# EAGLE schematic Schematic v42 (EAGLE 9.7.0)
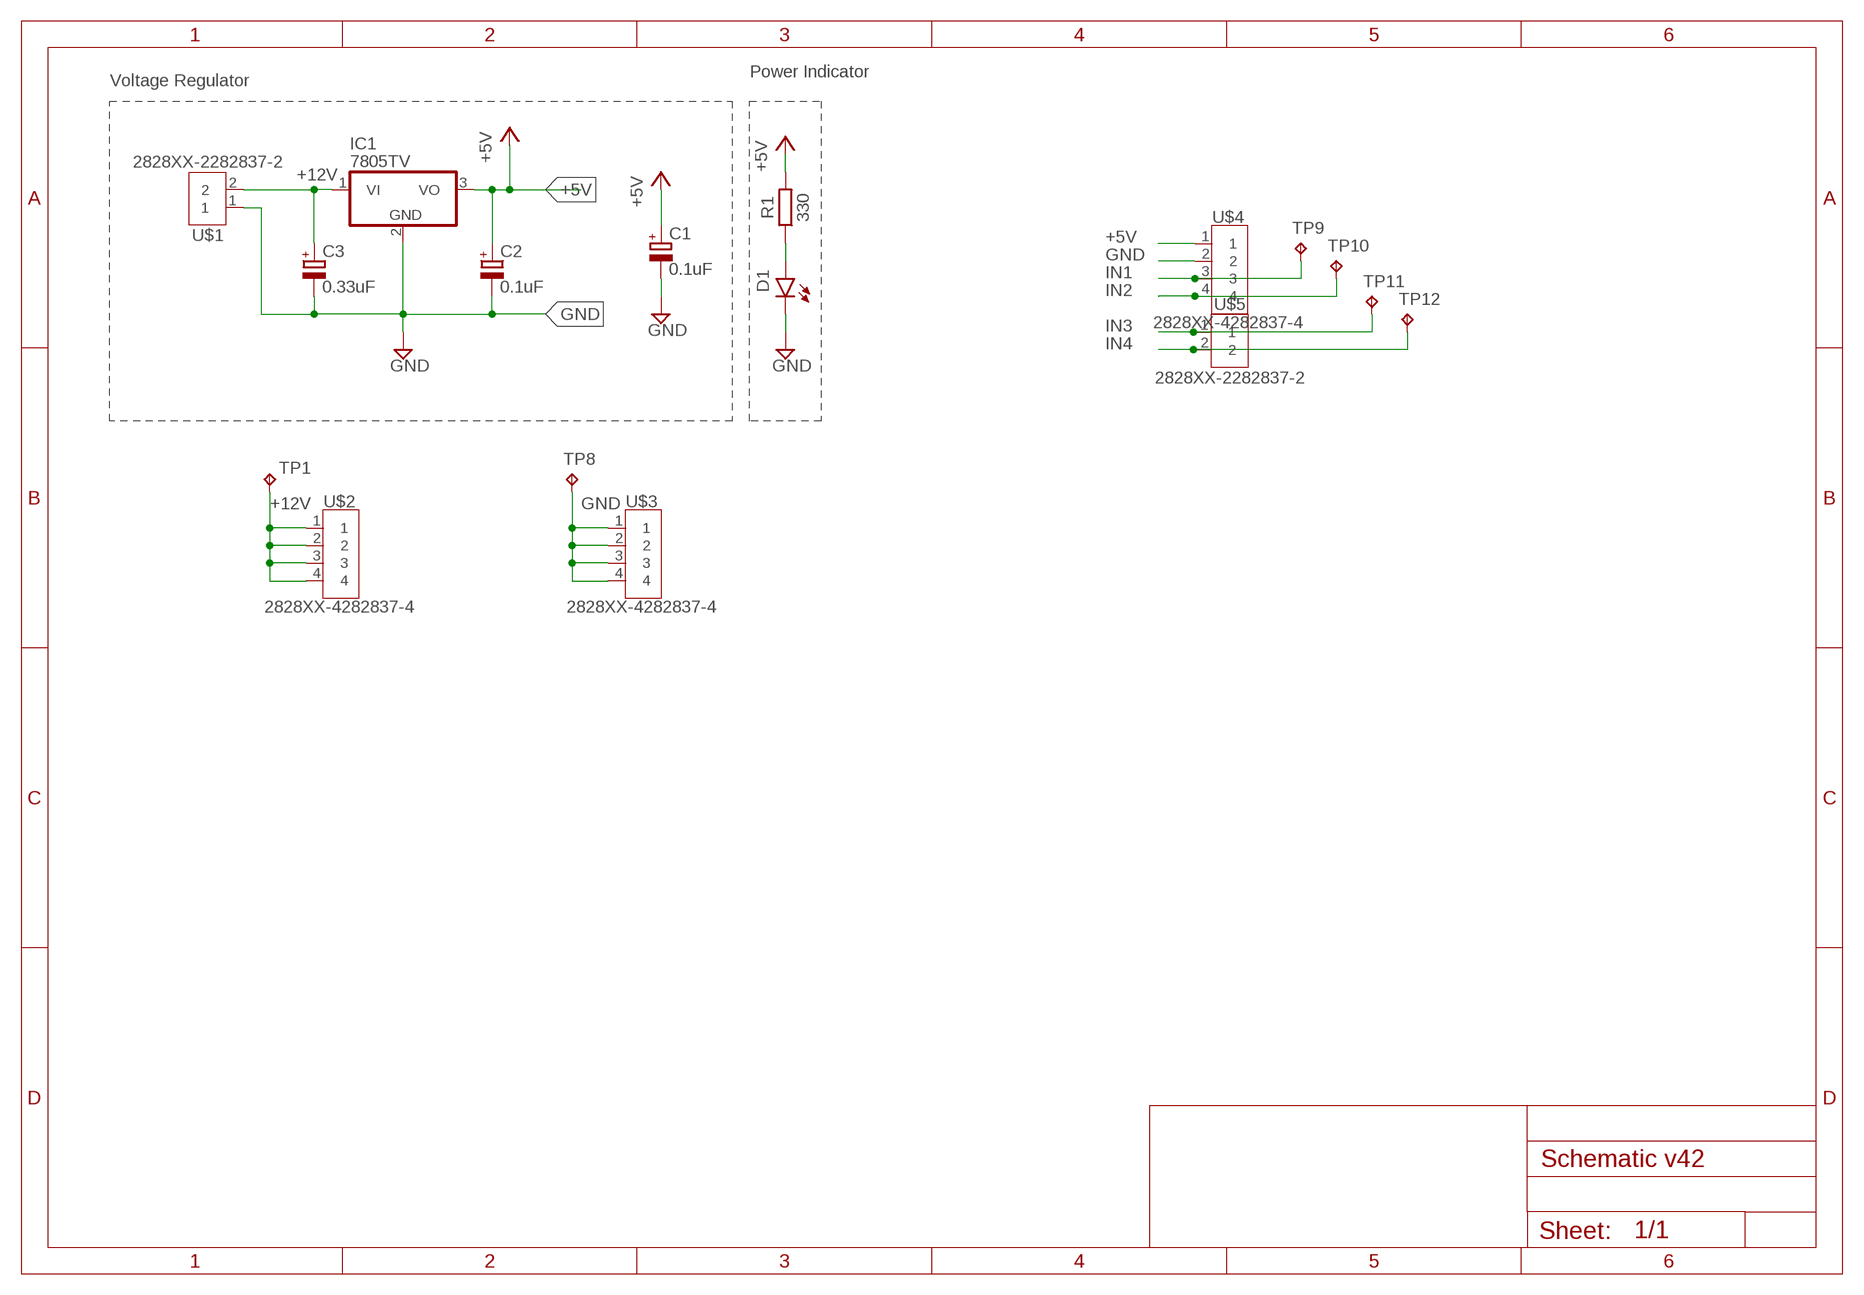
[diagram p0: schematic, sheet 1]

## Parts
C1  0.1uF  C-POL_RADIAL-11MM-DIA  [CAPPRD508W65D1000H1100B]
C2  0.1uF  C-POL_RADIAL-11MM-DIA  [CAPPRD508W65D1000H1100B]
C3  0.33uF  C-POL_RADIAL-25MM-DIA  [CAPPRD550W110D1250H2500B]
D1  LED_ORANGE  LED_RADIAL_ORANGE  [LEDRD254W60D565H860B_O]
IC1  7805TV  [TO220V]
R1  330  R_AXIAL-7.2MM-PITCH  [RESAD724W46L381D178B]
TP1  TPPAD1-20  [P1-20]
TP8  TPPAD1-20  [P1-20]
TP9  TPPAD1-20  [P1-20]
TP10  TPPAD1-20  [P1-20]
TP11  TPPAD1-20  [P1-20]
TP12  TPPAD1-20  [P1-20]
U$1  2828XX-2282837-2  [TERMBLK_508-2N]
U$2  2828XX-4282837-4  [TERMBLK_508-4N]
U$3  2828XX-4282837-4  [TERMBLK_508-4N]
U$4  2828XX-4282837-4  [TERMBLK_508-4N]
U$5  2828XX-2282837-2  [TERMBLK_508-2N]

## Nets
+5V: C1.1(+) C2.1(+) IC1.3(VO) R1.2 U$4.1
+12V: C3.1(+) IC1.1(VI) TP1.TP U$1.2 U$2.1 U$2.2 U$2.3 U$2.4
GND: C1.2(-) C2.2(-) C3.2(-) D1.2(C) IC1.2(GND) TP8.TP U$1.1 U$3.1 U$3.2 U$3.3 U$3.4 U$4.2
IN1: TP9.TP U$4.3
IN2: TP10.TP U$4.4
IN3: TP11.TP U$5.1
IN4: TP12.TP U$5.2
N$2: D1.1(A) R1.1

## Notes on the sheet
- Power Indicator
- Voltage Regulator

## Library data of the parts
C1-C3 = Capacitor:C-POL: Capacitor Polarised - Generic; CATEGORY: Capacitor
D1 = Tinkercad:LED_RADIAL: LED - Generic; CATEGORY: Opto-Electronic; SUB-CATEGORY: LED
IC1 = linear:78*: Positive VOLTAGE REGULATOR Source: http://cache.national.com/ds/LM/LM78L05.pdf http://www.fairchildsemi.com/ds/LM/LM7805.pdf
R1 = Resistor:R: Resistor Fixed - Generic; CATEGORY: Resistor; SUB-CATEGORY: Fixed
TP1 TP8-TP12 = testpad:TP: Test pad
U$1 = Connector:2828XX-2: 2 Position Wire to Board Terminal Block Horizontal with Board Datasheet <https://www.te.com.cn/commerce/DocumentDelivery/DDEController?Action=showdoc&DocId=Catalog+Section%7F1308389_EUROSTYLE_TERMINAL_BLOCKS%7F0607%7Fpdf%7FEnglish%7FENG_CS_1308389_EUROSTYLE_TERMINAL_BLOCKS_0607.pdf%7F2-282837-5>; CATEGORY: Connector; DESCRIPTION: 2 Position Wire to Board Terminal Block Horizontal with Board 5.08 mm Through Hole; MANUFACTURER: TE Connectivity; MPN: 282837-2; OPERATING_TEMPERATURE: -40°C to +105°C; PART_STATUS: ACTIVE; ROHS_COMPLIANCE: RoHS Compliant; SERIES: 282837; SPICEPREFIX: B; SUBCATEGORY: Terminal Block; TYPE: Side Wire Entry
U$2-U$4 = Connector:2828XX-4: 4 Position Wire to Board Terminal Block Horizontal with Board Datasheet <https://www.te.com.cn/commerce/DocumentDelivery/DDEController?Action=showdoc&DocId=Catalog+Section%7F1308389_EUROSTYLE_TERMINAL_BLOCKS%7F0607%7Fpdf%7FEnglish%7FENG_CS_1308389_EUROSTYLE_TERMINAL_BLOCKS_0607.pdf%7F2-282837-5>; CATEGORY: Connector; DESCRIPTION: TERM BLK 4P SIDE ENT 5.08mm PCB; MANUFACTURER: TE Connectivity; MPN: 282837-4; OPERATING_TEMPERATURE: 40°C to +105°C; PART_STATUS: Active; ROHS_COMPLIANCE: RoHS Compliant; SERIES: 283737; SUBCATEGORY: Terminal Block; TYPE: Side Wire Entry
U$5 = Connector:2828XX-2: 2 Position Wire to Board Terminal Block Horizontal with Board Datasheet <https://www.te.com.cn/commerce/DocumentDelivery/DDEController?Action=showdoc&DocId=Catalog+Section%7F1308389_EUROSTYLE_TERMINAL_BLOCKS%7F0607%7Fpdf%7FEnglish%7FENG_CS_1308389_EUROSTYLE_TERMINAL_BLOCKS_0607.pdf%7F2-282837-5>; CATEGORY: Connector; DESCRIPTION: 2 Position Wire to Board Terminal Block Horizontal with Board 5.08 mm Through Hole; MANUFACTURER: TE Connectivity; MPN: 282837-2; OPERATING_TEMPERATURE: -40°C to +105°C; PART_STATUS: ACTIVE; ROHS_COMPLIANCE: RoHS Compliant; SERIES: 282837; SUBCATEGORY: Terminal Block; TYPE: Side Wire Entry